# Altium schematic sheet LCD-Connecteur-KS0108.SchDoc: LCD - Connecteurs
size Letter; ApprovedBy: kc; Organization: Cegep Limoilou; Address1: 1300, 8e Avenue; Address2: Québec, QC; Address3: Canada; Address4: G1J 5L5; SheetNumber: 10; SheetTotal: 10
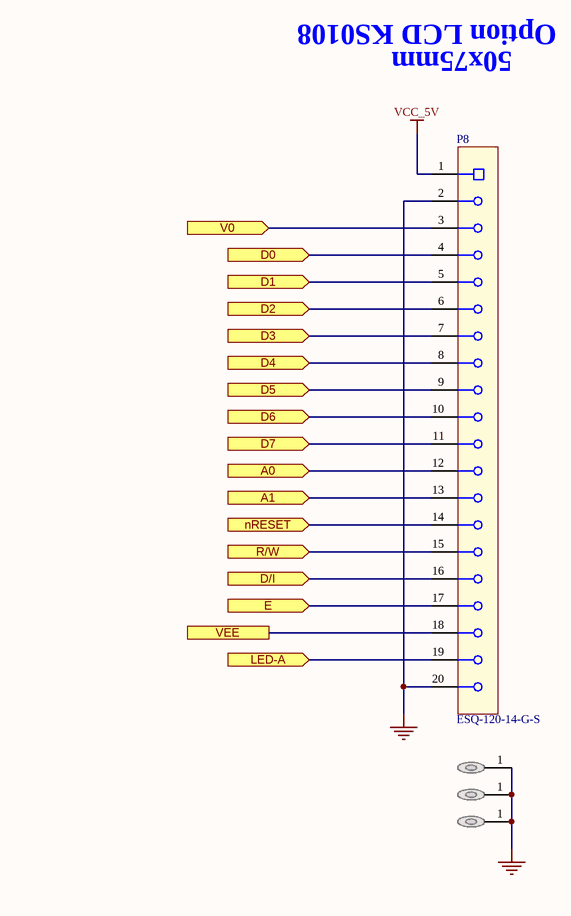
[diagram p0: LCD-Connecteur-KS0108.SchDoc]

## Parts
MH6  DNP  [MP_M-Hole_M2.5x0.45mm_LOOSE-FIT]  (value not drawn)  (no BOM)
MH7  DNP  [MP_M-Hole_M2.5x0.45mm_LOOSE-FIT]  (value not drawn)  (no BOM)
MH8  DNP  [MP_M-Hole_M2.5x0.45mm_LOOSE-FIT]  (value not drawn)  (no BOM)
P8  ESQ-120-14-G-S  [CONN-SKT-20POS-100MIL]  (no BOM)

## Ports
A0 (in, see Affichage-LCD[3B]), A1 (in, see Affichage-LCD[3B]), D0 (in, see Affichage-LCD[3B], LCD-Connecteur-ST7920[2B]), D1 (in, see Affichage-LCD[3B], LCD-Connecteur-ST7920[2B]), D2 (in, see Affichage-LCD[3B], LCD-Connecteur-ST7920[2B]), D3 (in, see Affichage-LCD[3B], LCD-Connecteur-ST7920[2B]), D4 (in, see Affichage-LCD[3B], LCD-Connecteur-ST7920[2B]), D5 (in, see Affichage-LCD[3B], LCD-Connecteur-ST7920[2C]), D6 (in, see Affichage-LCD[3B], LCD-Connecteur-ST7920[2C]), D7 (in, see Affichage-LCD[3B], LCD-Connecteur-ST7920[2C]), D/I (in, see Affichage-LCD[3B]), E (in, see Affichage-LCD[3B], LCD-Connecteur-ST7920[2B]), LED-A (in, see Affichage-LCD[3B], LCD-Connecteur-ST7920[2C]), nRESET (in, see Affichage-LCD[3B], LCD-Connecteur-ST7920[2C]), R/W (in, see Affichage-LCD[3B], LCD-Connecteur-ST7920[2B]), V0 (in, see Affichage-LCD[3B]), VEE (see Affichage-LCD[3B])

## Nets
GND: MH6.1 MH7.1 MH8.1 P8.2 P8.20
VCC_5V: P8.1
A0: P8.12 ; port A0
A1: P8.13 ; port A1
D0: P8.4 ; port D0
D1: P8.5 ; port D1
D2: P8.6 ; port D2
D3: P8.7 ; port D3
D4: P8.8 ; port D4
D5: P8.9 ; port D5
D6: P8.10 ; port D6
D7: P8.11 ; port D7
D/I: P8.16 ; port D/I
E: P8.17 ; port E
LED-A: P8.19 ; port LED-A
nRESET: P8.14 ; port nRESET
R/W: P8.15 ; port R/W
V0: P8.3 ; port V0
VEE: P8.18 ; port VEE

## Notes on the sheet
- Option LCD KS0108
- 50x75mm
- Titre :
- Conception :
- Date :
- Approbation :
- Heure :
- Révision :
- Feuille
- de
- Fichier :

## Library data of the parts
MH6-MH8 = MH-2.5MM: Mounting Hole 2.5mm w/ Flat Washer; Manufacturer Part Number 1: DNP; Value: DNP; Supplier Part Number 1: N/A
P8 = CONN-100MIL-SKT-01X20: CONN SOCKET 20POS 2.54MM; Manufacturer 1: Megastar; Manufacturer Part Number 1: ZX-PM2.54-1-20PY; Code CEGEP: KCONDIV0053; Localisation: R13-B035; Mounting Technology: TH; Supplier 1: LCSC; Supplier Part Number 1: C7499336